# EAGLE design i2c_kbd6 (EAGLE 7.6.0)
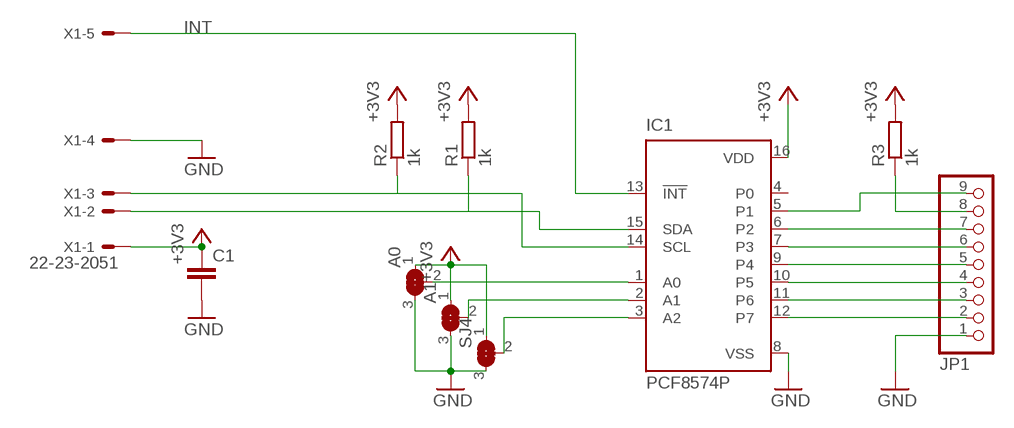
[diagram p0: schematic, sheet 1]

## Parts
A0  SOLDERJUMPER_2WAY0805  [SOLDERJUMPER_2WAY_OPEN_0805]
A1  SOLDERJUMPER_2WAY0805  [SOLDERJUMPER_2WAY_OPEN_0805]
C1  C-EUC0805  [C0805]
IC1  PCF8574P  [DIL16]
JP1  PINHD-1X9/90  [1X09/90]
R1  1k  R-EU_R0805  [R0805]
R2  1k  R-EU_R0805  [R0805]
R3  1k  R-EU_R0805  [R0805]
SJ4  SOLDERJUMPER_2WAY0805  [SOLDERJUMPER_2WAY_OPEN_0805]
X1  22-23-2051  [22-23-2051]

## Nets
+3V3: A0.1 A1.1 C1.1 IC1.16(VDD) R1.2 R2.2 R3.2 SJ4.1 X1.1
A2: IC1.3(A2) SJ4.2
GND: A0.3 A1.3 C1.2 IC1.8(VSS) JP1.1 SJ4.3 X1.4
INT: IC1.13(!INT) X1.5
N$1: IC1.15(SDA) R1.1 X1.2
N$2: IC1.14(SCL) R2.1 X1.3
N$4: A0.2 IC1.1(A0)
N$5: A1.2 IC1.2(A1)
N$8: IC1.12(P7) JP1.2
N$9: IC1.11(P6) JP1.3
N$10: IC1.10(P5) JP1.4
N$11: IC1.9(P4) JP1.5
N$12: IC1.7(P3) JP1.6
N$13: IC1.6(P2) JP1.7
N$14: IC1.5(P1) JP1.9
N$15: JP1.8 R3.1
Unconnected: IC1.4(P0)

## Library data of the parts
A0 A1 SJ4 = MyLib:SOLDERJUMPER_2WAY: 2-Way Solder Jumper
C1 = rcl:C-EU: CAPACITOR, European symbol
IC1 = micro-philips:PCF8574: I2C-Bus Remote 8-bit I/O expander http://www.semiconductors.philips.com/acrobat_download/datasheets/PCF8574_4.pdf; MPN: PCF8574PN; OC_FARNELL: 204020; OC_NEWARK: 11N8515
JP1 = pinhead:PINHD-1X9: PIN HEADER
R1-R3 = rcl:R-EU_: RESISTOR, European symbol
X1 = con-molex:22-23-2051: .100" (2.54mm) Center Header - 5 Pin; MF: MOLEX; MPN: 22-23-2051; OC_FARNELL: 1462952; OC_NEWARK: 38C9178

## Board
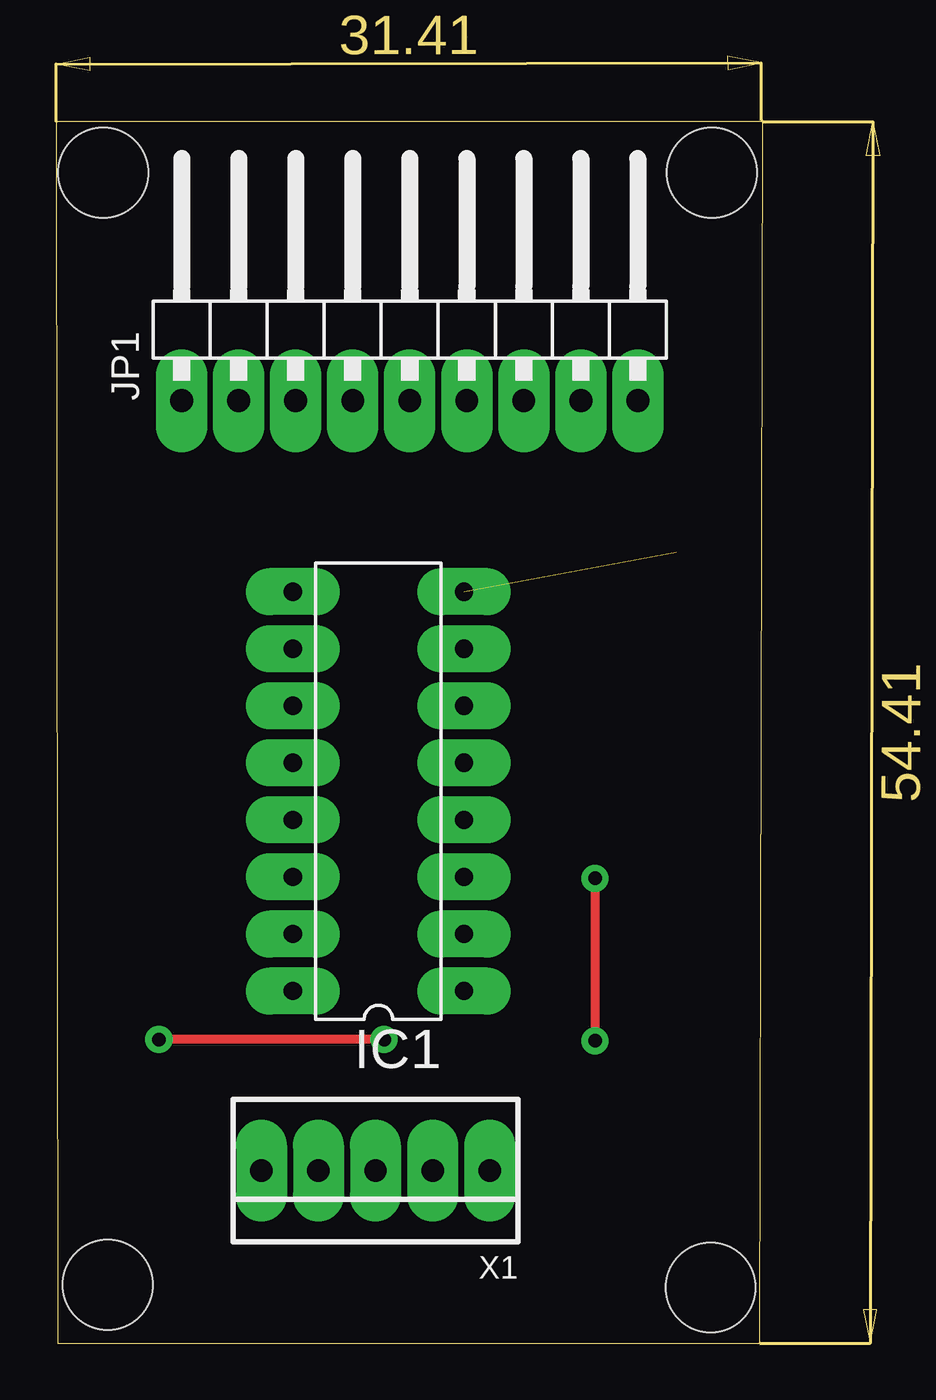
[diagram p1: board, top side]
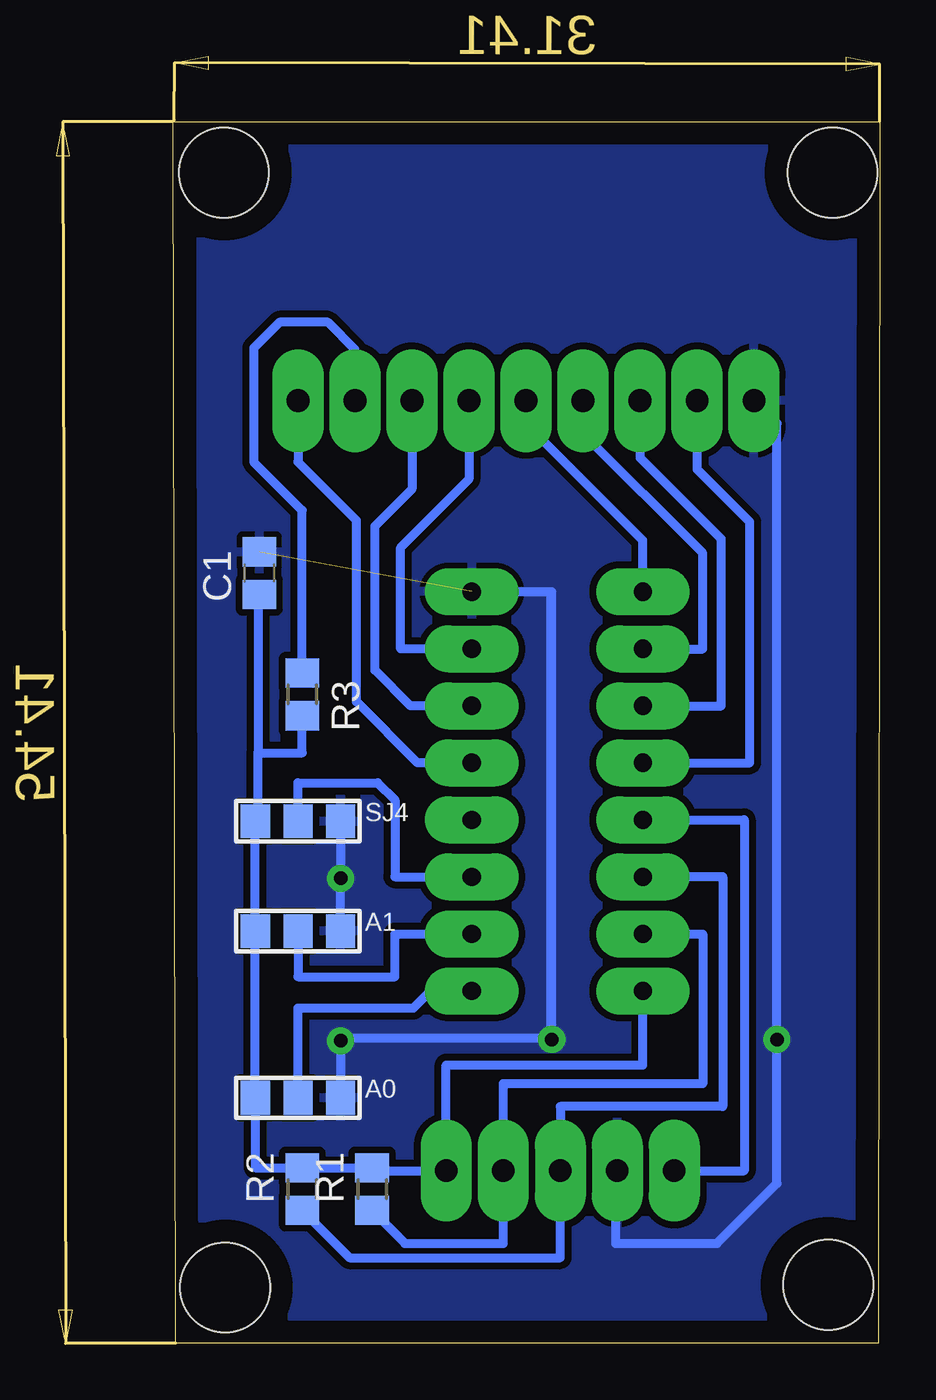
[diagram p2: board, bottom side, seen from below]

Size 31.48 x 54.41 mm. Coordinates in mm from the lower left corner, seen from the top.
Outline: 0.06,0 31.35,0 31.48,54.41 0,54.41 0.06,0
Copper layers (1*16): Top 0.035mm / dielectric 1.5mm / Bottom 0.035mm
Design rules "default": minimum track width 10mil, minimum drill 32mil, track to track 12mil, track to pad 12mil, pad to pad 12mil, via to via 12mil, smd to smd 8mil, copper to edge 40mil, drill to drill 40mil, minimum pad ring 25mil, minimum via ring 12mil, stop-mask expansion 4mil, vias tented up to drill 0mil, thermal gap 10mil
Holes 3.99 mm at 2.1,52.13 29.21,52.13 2.29,2.6 29.15,2.48

### Footprints (pad centres in the part's own frame; a part is rotated, then mirrored left to right if it is on the bottom)
SOLDERJUMPER_2WAY_OPEN_0805 = smd 1.3 x 1.5: 1 -1.9,0; 2 0,0; 3 1.9,0
C0805 = smd 1.3 x 1.5: 1 -0.95,0; 2 0.95,0
DIL16 = drill 0.813 long: 1 -8.89,-3.81; 2 -6.35,-3.81; 3 -3.81,-3.81; 4 -1.27,-3.81; 5 1.27,-3.81; 6 3.81,-3.81; 7 6.35,-3.81; 8 8.89,-3.81; 9 8.89,3.81; 10 6.35,3.81; 11 3.81,3.81; 12 1.27,3.81; 13 -1.27,3.81; 14 -3.81,3.81; 15 -6.35,3.81; 16 -8.89,3.81
1X09/90 = drill 1.016 long: 1 -10.16,-3.81; 2 -7.62,-3.81; 3 -5.08,-3.81; 4 -2.54,-3.81; 5 0,-3.81; 6 2.54,-3.81; 7 5.08,-3.81; 8 7.62,-3.81; 9 10.16,-3.81
R0805 = smd 1.3 x 1.5: 1 -0.95,0; 2 0.95,0
22-23-2051 = drill 1 long: 1 -5.08,0; 2 -2.54,0; 3 0,0; 4 2.54,0; 5 5.08,0

### Placement (x,y rotation side)
A0  25.91,10.92 0 bottom
A1  25.91,18.35 0 bottom
C1  27.62,34.29 90 bottom
IC1  14.35,24.57 90 top
JP1  15.75,45.78 0 top
R1  22.61,6.86 90 bottom
R2  25.72,6.86 90 bottom
R3  25.72,28.89 270 bottom
SJ4  25.91,23.24 0 bottom
X1  14.22,7.68 180 top

### Tracks (layer width: path | path; a pad name or v marks a point on that pad's centre or on a via)
+3V3
  Bottom 0.406: X1.1 19.3,12.38 10.54,12.38 IC1.16 | 27.68,26.29 27.68,23.24 SJ4.1 A1.1 A0.1 27.81,7.81 R2.2 R1.2 22.48,7.68 X1.1 | 27.68,26.29 25.72,26.29 R3.2 | X1.1 19.3,7.81 | C1.1 27.68,33.34 27.68,26.29
A2
  Bottom 0.406: SJ4.2 25.91,24.96 22.35,24.96 21.59,24.19 21.59,20.77 IC1.3
GND  (via drill 0.6)  (1 unrouted)
  Top 0.406: v24,20.7 v24,13.46 | v14.61,13.53 v4.57,13.53
  Bottom 0.406: A1.3 v24.01,20.7 | SJ4.3 v24.01,20.7 | v24.01,20.7 v24,20.7 | X1.4 11.75,7.68 11.75,4.45 7.24,4.45 4.57,7.11 v4.57,13.53 4.57,40.96 JP1.1 | IC1.8 14.67,33.47 | 14.67,33.47 14.67,13.59 24,13.59 v24,13.46 A0.3 | 14.67,33.47 14.61,33.47 v14.61,13.53
  pour Bottom: 0.06,54.36 31.31,54.55 31.31,0 0.06,-0.19
INT
  Bottom 0.406: IC1.13 6.03,23.3 6.03,7.68 X1.5
N$1
  Bottom 0.406: IC1.15 7.87,18.23 7.87,11.56 16.76,11.56 X1.2 16.76,4.45 21.14,4.45 R1.1
N$2
  Bottom 0.406: IC1.14 6.99,20.77 6.99,10.54 14.22,10.54 X1.3 14.22,3.81 23.62,3.81 R2.1
N$4
  Bottom 0.406: A0.2 25.91,14.92 20.77,14.92 20,15.69 IC1.1
N$5
  Bottom 0.406: IC1.2 21.59,18.23 21.59,16.32 25.91,16.32 A1.2
N$8
  Bottom 0.406: IC1.12 5.78,25.84 5.78,36.58 8.13,38.93 JP1.2
N$9
  Bottom 0.406: IC1.11 7.05,28.39 7.05,35.81 10.67,39.43 JP1.3
N$10
  Bottom 0.406: IC1.10 7.87,30.93 7.87,35.18 13.21,40.51 JP1.4
N$11
  Bottom 0.406: IC1.9 10.54,35.75 15.75,40.96 JP1.5
N$12
  Bottom 0.406: IC1.7 21.34,30.93 21.34,35.43 18.29,38.48 JP1.6
N$13
  Bottom 0.406: IC1.6 20.89,28.39 22.48,29.97 22.48,36.39 20.83,38.04 JP1.7
N$14
  Bottom 0.406: IC1.5 20.57,25.84 23.3,28.58 23.3,36.64 25.91,39.24 JP1.9
N$15
  Bottom 0.406: R3.1 25.72,37.08 27.88,39.24 27.88,44.32 26.73,45.47 24.57,45.47 23.37,44.26 JP1.8